# EAGLE design EC (EAGLE 6.2)
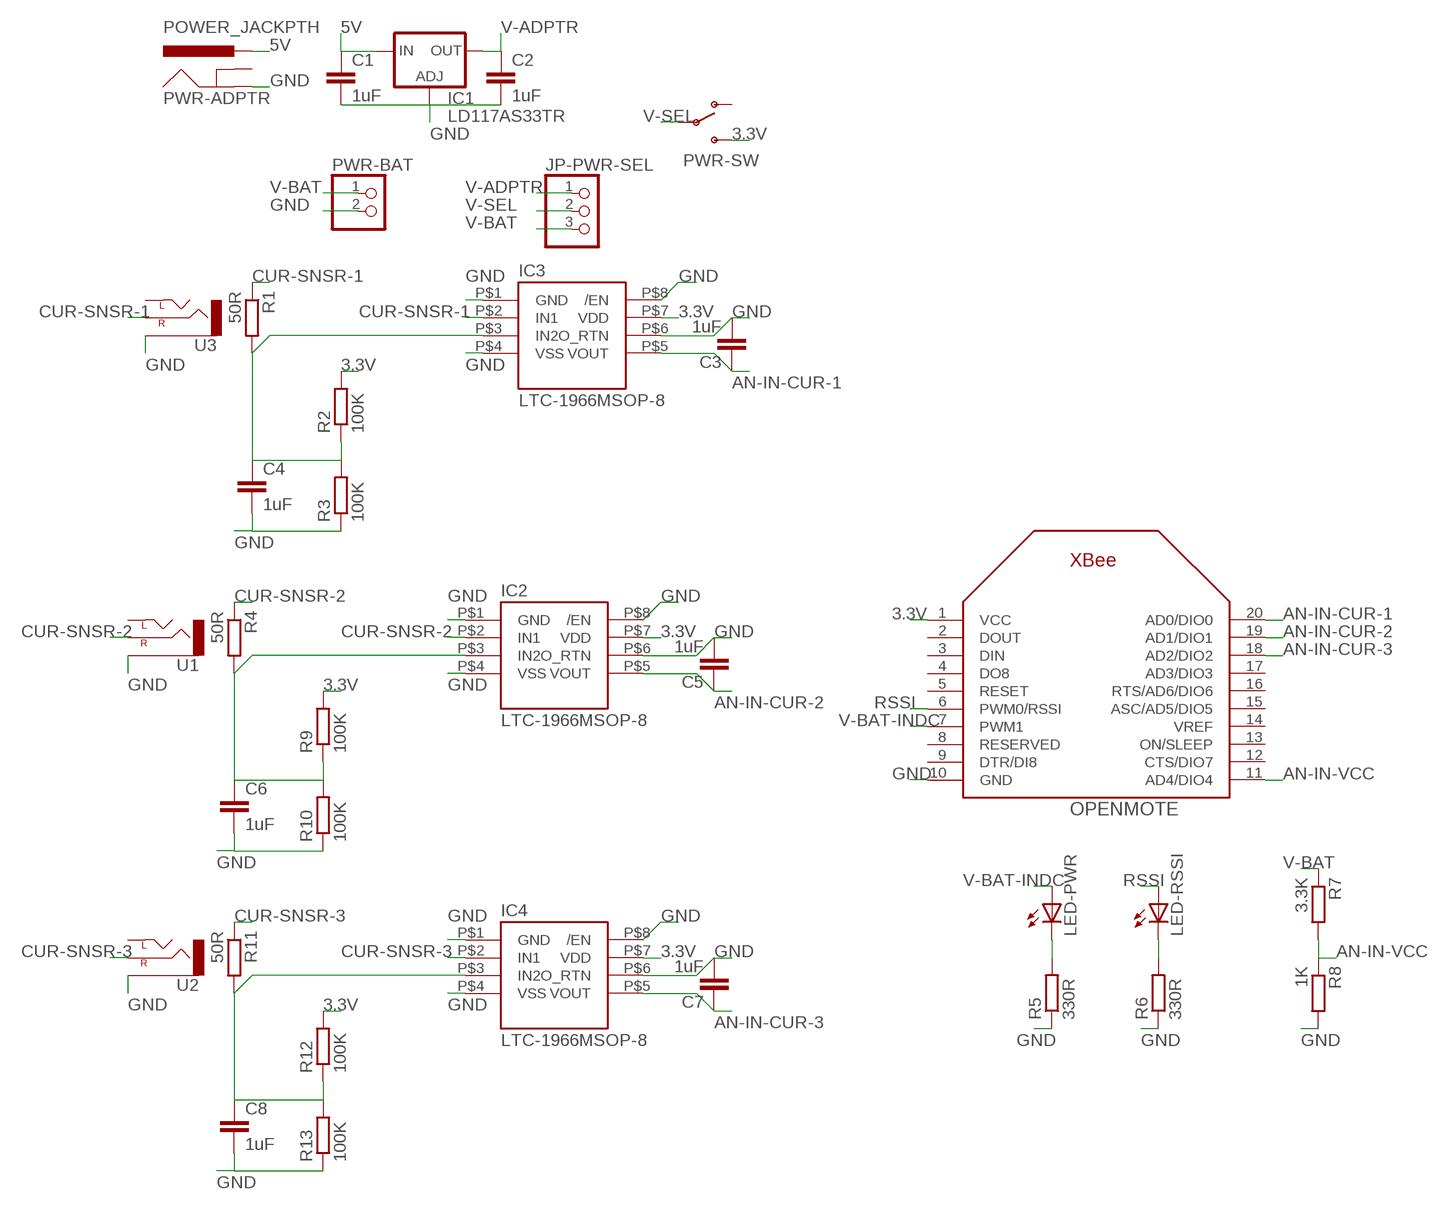
[diagram p0: schematic, sheet 1]

## Parts
C1  1uF  C-EUC0805  [C0805]
C2  1uF  C-EUC0805  [C0805]
C3  1uF  C-EUC0805  [C0805]
C4  1uF  C-EUC0805  [C0805]
C5  1uF  C-EUC0805  [C0805]
C6  1uF  C-EUC0805  [C0805]
C7  1uF  C-EUC0805  [C0805]
C8  1uF  C-EUC0805  [C0805]
IC1  LD117AS33TR  [SOT223]
IC2  LTC-1966MSOP-8  [MSOP-8]
IC3  LTC-1966MSOP-8  [MSOP-8]
IC4  LTC-1966MSOP-8  [MSOP-8]
JP-PWR-SEL  PINHD-1X3  [1X03]
LED-PWR  LED0603  [LED-0603]
LED-RSSI  LED0603  [LED-0603]
OPENMOTE  XBEE  [XBEE]
PWR-ADPTR  POWER_JACKPTH  [POWER_JACK_PTH]
PWR-BAT  PINHD-1X2  [1X02]
PWR-SW  SWITCH-SPDTSMD2  [SWITCH-SPDT-SMD]
R1  50R  R-EU_R0603  [R0603]
R2  100K  R-EU_R0603  [R0603]
R3  100K  R-EU_R0603  [R0603]
R4  50R  R-EU_R0603  [R0603]
R5  330R  R-EU_R0603  [R0603]
R6  330R  R-EU_R0603  [R0603]
R7  3.3K  R-EU_R0603  [R0603]
R8  1K  R-EU_R0603  [R0603]
R9  100K  R-EU_R0603  [R0603]
R10  100K  R-EU_R0603  [R0603]
R11  50R  R-EU_R0603  [R0603]
R12  100K  R-EU_R0603  [R0603]
R13  100K  R-EU_R0603  [R0603]
U1  AUDIO-JACKSMD2  [AUDIO-JACK-3.5MM-SMD]
U2  AUDIO-JACKSMD2  [AUDIO-JACK-3.5MM-SMD]
U3  AUDIO-JACKSMD2  [AUDIO-JACK-3.5MM-SMD]

## Nets
3.3V: IC2.P$7(VDD) IC3.P$7(VDD) IC4.P$7(VDD) OPENMOTE.1(VCC) PWR-SW.3(S) R2.2 R9.2 R12.2
5V: C1.1 IC1.3(IN) PWR-ADPTR.PWR
AN-IN-CUR-1: C3.1 IC3.P$5(VOUT) OPENMOTE.20(AD0/DIO0)
AN-IN-CUR-2: C5.1 IC2.P$5(VOUT) OPENMOTE.19(AD1/DIO1)
AN-IN-CUR-3: C7.1 IC4.P$5(VOUT) OPENMOTE.18(AD2/DIO2)
AN-IN-VCC: OPENMOTE.11(AD4/DIO4) R7.2 R8.1
CUR-SNSR-1: IC3.P$2(IN1) R1.1 U3.RING(RIGHT)
CUR-SNSR-2: IC2.P$2(IN1) R4.1 U1.RING(RIGHT)
CUR-SNSR-3: IC4.P$2(IN1) R11.1 U2.RING(RIGHT)
GND: C1.2 C2.2 C3.2 C4.2 C5.2 C6.2 C7.2 C8.2 IC1.1(ADJ) IC2.P$1(GND) IC2.P$4(VSS) IC2.P$6(O_RTN) IC2.P$8(/EN) IC3.P$1(GND) IC3.P$4(VSS) IC3.P$6(O_RTN) IC3.P$8(/EN) IC4.P$1(GND) IC4.P$4(VSS) IC4.P$6(O_RTN) IC4.P$8(/EN) OPENMOTE.10(GND) PWR-ADPTR.GND PWR-BAT.2 R3.1 R5.1 R6.1 R8.2 R10.1 R13.1 U1.SLEEVE U2.SLEEVE U3.SLEEVE
N$1: LED-PWR.C R5.2
N$2: LED-RSSI.C R6.2
N$3: C4.1 IC3.P$3(IN2) R1.2 R2.1 R3.2
N$4: C6.1 IC2.P$3(IN2) R4.2 R9.1 R10.2
N$5: C8.1 IC4.P$3(IN2) R11.2 R12.1 R13.2
RSSI: LED-RSSI.A OPENMOTE.6(PWM0/RSSI)
V-ADPTR: C2.1 IC1.4(OUT) JP-PWR-SEL.1
V-BAT: JP-PWR-SEL.3 PWR-BAT.1 R7.1
V-BAT-INDC: LED-PWR.A OPENMOTE.7(PWM1)
V-SEL: JP-PWR-SEL.2 PWR-SW.2(P)
Unconnected: OPENMOTE.2(DOUT) OPENMOTE.3(DIN) OPENMOTE.4(DO8) OPENMOTE.5(RESET) OPENMOTE.8(RESERVED) OPENMOTE.9(DTR/DI8) OPENMOTE.12(CTS/DIO7) OPENMOTE.13(ON/SLEEP) OPENMOTE.14(VREF) OPENMOTE.15(ASC/AD5/DIO5) OPENMOTE.16(RTS/AD6/DIO6) OPENMOTE.17(AD3/DIO3) PWR-ADPTR.GNDBREAK PWR-SW.1(O) U1.TIP(LEFT) U2.TIP(LEFT) U3.TIP(LEFT)

## Library data of the parts
C1-C8 = resistor:C-EU: CAPACITOR, European symbol
IC1 = v-reg:LD117A?*: Low drop fixed and adjustable positive voltage regulators 1 A Source: http://www.st.com/stonline/products/literature/ds/7194/ld1117axx.pdf
IC2-IC4 = custom-tigor:LTC-1966
JP-PWR-SEL = pinhead:PINHD-1X3: PIN HEADER
LED-PWR LED-RSSI = SparkFun-LED:LED: LEDs Standard schematic elements and footprints for 5mm, 3mm, 1206, and 0603 sized LEDs. 5mm - Spark Fun Electronics SKU : COM-00529 (and others)
OPENMOTE = adafruit:XBEE
PWR-ADPTR = SparkFun-Connectors:POWER_JACK: Power Jack This is the standard 5.5mm barrel jack for power. The PTH is the most common, proven, reliable, footprint. The Slot footprint only works if the mill layer is transmitted to the PCB fab house so be warned. Spark Fun Electronics SKU : PRT-00119 SMT: CONN-08106 Mating wall wart : TOL-00298 (and others)
PWR-BAT = pinhead:PINHD-1X2: PIN HEADER
PWR-SW = SparkFun-Electromechanical:SWITCH-SPDT: SPDT Switch Simple slide switch, Spark Fun Electronics SKU : COM-00102 DPDT SMT slide switch, AYZ0202, SWCH-08179
R1-R13 = resistor:R-EU_: RESISTOR, European symbol
U1-U3 = SparkFun-Connectors:AUDIO-JACK: 3.5mm Audio Jack Simple 3.5mm common PCB mount audio jack. SKU: PRT-08032

## Board
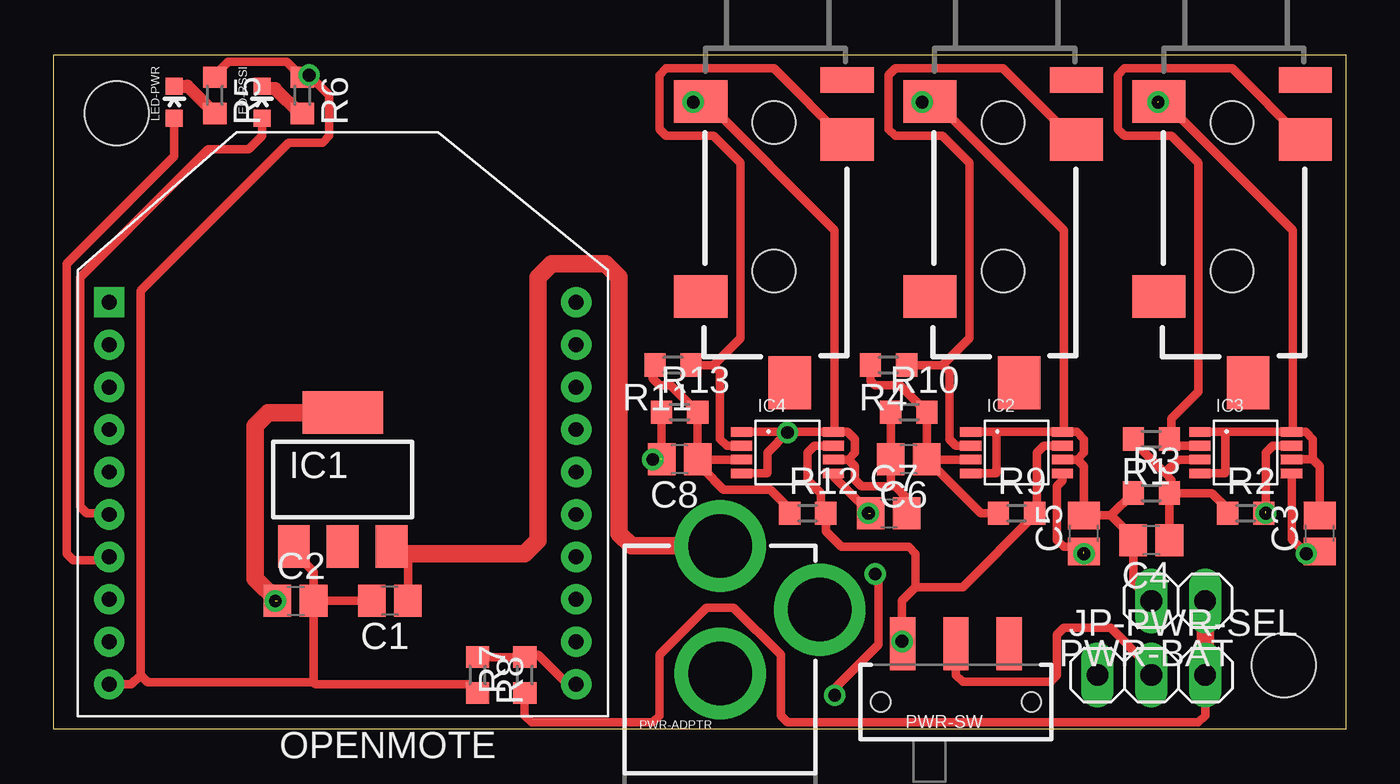
[diagram p1: board, top side]
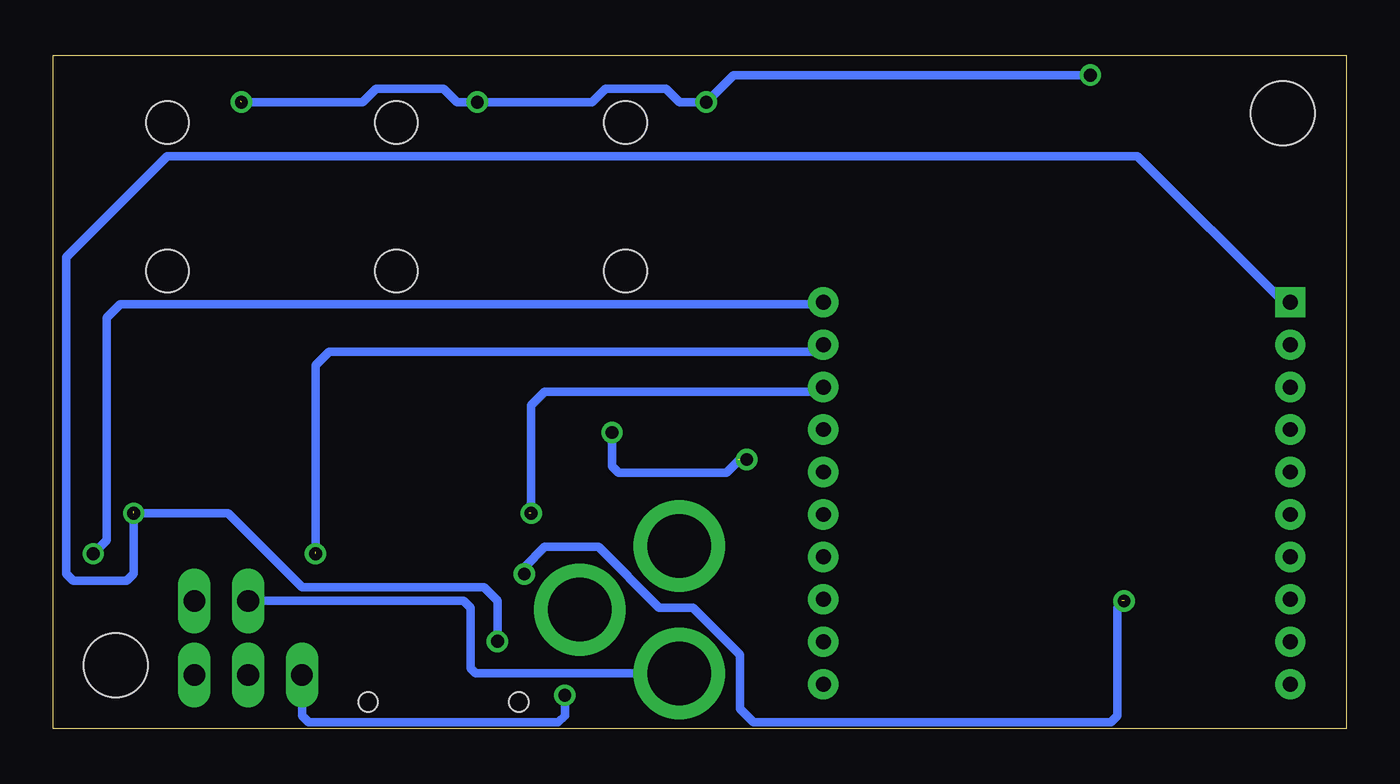
[diagram p2: board, bottom side, seen from below]

Size 60.95 x 31.74 mm. Coordinates in mm from the lower left corner, seen from the top.
Outline: 0,0 60.95,0 60.95,31.74 0,31.74 0,0
Copper layers (1*16): Top 0.035mm / dielectric 1.5mm / Bottom 0.035mm
Design rules: minimum track width 10mil, minimum drill 24mil, track to track 8mil, track to pad 8mil, pad to pad 8mil, via to via 8mil, smd to smd 8mil, copper to edge 40mil, drill to drill 8mil, minimum pad ring 10mil, minimum via ring 8mil, stop-mask expansion 4mil, vias tented up to drill 0mil, thermal gap 10mil
Holes 3 mm at 3,29 58,3

### Footprints (pad centres in the part's own frame; a part is rotated, then mirrored left to right if it is on the bottom)
C0805 = smd 1.3 x 1.5: 1 -0.85,0; 2 0.85,0
SOT223 = smd 1.5 x 2: 1 -2.3,-3.15; 2 0,-3.15; 3 2.3,-3.15 | smd 3.8 x 2: 4 0,3.15
MSOP-8 = smd 0.45 x 1: P$1 -0.975,-2.165; P$2 -0.325,-2.165; P$3 0.325,-2.165; P$4 0.975,-2.165; P$5 0.975,2.165; P$6 0.325,2.165; P$7 -0.325,2.165; P$8 -0.975,2.165
1X03 = drill 1.016 long: 1 -2.54,0; 2 0,0; 3 2.54,0
LED-0603 = smd 0.8 x 0.8: A 0,-0.75; C 0,0.75
XBEE = drill 0.7 pad 1.422 square: 1 -11,5.5 | drill 0.7 pad 1.422: 2 -11,3.5; 3 -11,1.5; 4 -11,-0.5; 5 -11,-2.5; 6 -11,-4.5; 7 -11,-6.5; 8 -11,-8.5; 9 -11,-10.5; 10 -11,-12.5; 11 11,-12.5; 12 11,-10.5; 13 11,-8.5; 14 11,-6.5; 15 11,-4.5; 16 11,-2.5; 17 11,-0.5; 18 11,1.5; 19 11,3.5; 20 11,5.5
POWER_JACK_PTH = drill 2.997 pad 4.318: GND 0,7.7; GNDBREAK 4.7,10.7; PWR 0,13.7
1X02 = drill 1.016 long: 1 -1.27,0; 2 1.27,0
SWITCH-SPDT-SMD = smd 1.2 x 2.5: 1 -2.5,-2.75; 2 0,-2.75; 3 2.5,-2.75 | hole 0.9: -3.55,0; 3.55,0
R0603 = smd 1 x 1.1: 1 -0.85,0; 2 0.85,0
AUDIO-JACK-3.5MM-SMD = smd 2 x 2.5: RING 4.3,3.45; SLEEVE 2.5,-3.45; TIP 11.7,-3.45 | smd 1.2 x 2.5: RSH 1.5,3.45 | smd 2.5 x 2: TSH 15.75,0.75 | hole 2: 3.5,0; 10.5,0

### Placement (x,y rotation side)
C1  15.88,6.03 180 top
C2  11.43,6.03 0 top
C3  59.69,9.21 90 top
C4  51.75,8.89 180 top
C5  48.58,9.21 90 top
C6  40.32,12.7 180 top
C7  39.37,10.16 0 top
C8  29.53,12.7 180 top
IC1  13.65,11.75 0 top
IC2  45.4,13.02 270 top
IC3  56.2,13.02 270 top
IC4  34.61,13.02 270 top
JP-PWR-SEL  51.75,2.54 0 top
LED-PWR  5.71,29.53 0 top
LED-RSSI  9.84,29.53 0 top
OPENMOTE  13.65,14.61 0 top
PWR-ADPTR  31.43,-5.08 0 top
PWR-BAT  53.02,6.03 180 top
PWR-SW  42.55,1.27 180 top
R1  51.75,13.65 180 top
R2  56.2,10.16 0 top
R3  51.75,11.11 0 top
R4  39.37,17.14 180 top
R5  7.62,29.84 270 top
R6  11.75,29.84 270 top
R7  22.23,2.54 90 top
R8  20,2.54 270 top
R9  45.4,10.16 0 top
R10  40.32,14.92 0 top
R11  29.21,17.14 180 top
R12  35.56,10.16 0 top
R13  29.53,14.92 0 top
U1  44.77,32.07 270 top
U2  33.97,32.07 270 top
U3  55.56,32.07 270 top

### Tracks (layer width: path | path; a pad name or v marks a point on that pad's centre or on a via)
3.3V  (via drill 0.6)  (1 unrouted)
  Top 0.406: IC3.P$7 57.48,13.34 57.15,13.02 57.15,10.26 R2.2 | IC2.P$7 46.68,13.34 46.35,13.02 46.35,10.26 R9.2 46.25,10.06 42.86,6.67 40.64,6.67 | PWR-SW.3 40.01,4.06 v40.01,4.13 40.01,6.03 40.64,6.67 | IC4.P$7 35.88,13.34 35.56,13.02 35.56,11.75 36.2,11.11 36.2,10.38 R12.2 36.41,9.31 37.15,8.57 40.32,8.57 40.64,8.26 40.64,6.67
  Bottom 0.406: v40.01,4.13 40.01,6.03 40.64,6.67 49.21,6.67 52.7,10.16 v57.15,10.16 57.15,7.3 57.47,6.99 60.01,6.99 60.33,7.3 60.33,22.23 55.56,26.99 9.84,26.99 2.96,20.11 OPENMOTE.1
5V
  Top 0.406: C1.1 16.73,7.83 IC1.3
  Top 0.813: PWR-ADPTR.PWR 27.26,8.62 26.67,9.21 26.67,21.27 26.04,21.91 23.5,21.91 22.86,21.27 22.86,8.89 22.23,8.26 16.3,8.26 IC1.3
AN-IN-CUR-1  (via drill 0.6)
  Top 0.406: C3.1 59.59,8.26 v59.05,8.26 58.36,8.95 IC3.P$5
  Bottom 0.406: v59.05,8.26 58.42,8.89 58.42,19.37 57.78,20 24.75,20 OPENMOTE.20
AN-IN-CUR-2  (via drill 0.6)  (1 unrouted)
  Top 0.406: IC2.P$5 47.57,11.69 47.31,11.43 47.31,8.89 47.62,8.57 48.36,8.57 C5.1
  Bottom 0.406: v48.58,8.26 48.58,17.14 47.94,17.78 24.98,17.78 OPENMOTE.19
AN-IN-CUR-3  (via drill 0.6)  (1 unrouted)
  Top 0.406: IC4.P$5 36.77,11.91 C7.1
  Bottom 0.406: v38.42,10.16 38.42,15.24 37.78,15.88 24.88,15.88 OPENMOTE.18
AN-IN-VCC
  Top 0.406: OPENMOTE.11 24.25,2.1 22.86,3.49 22.33,3.49 R7.2 R8.1
CUR-SNSR-1
  Top 0.406: U3.RING 58.91,27.77 55.56,31.11 50.48,31.11 50.16,30.8 50.16,28.26 50.48,27.94 52.7,27.94 53.98,26.67 53.98,15.88 52.7,14.61 52.7,13.76 R1.1 52.91,13.34 IC3.P$2
CUR-SNSR-2
  Top 0.406: IC2.P$2 42.54,13.34 42.23,13.65 42.23,16.83 41.91,17.14 | R4.1 41.91,17.14 | U1.RING 48.12,27.77 44.77,31.11 39.69,31.11 39.37,30.8 39.37,28.26 39.69,27.94 41.91,27.94 43.18,26.67 43.18,18.41 41.91,17.14
CUR-SNSR-3
  Top 0.406: 31.11,17.14 31.43,16.83 31.43,13.65 31.75,13.34 IC4.P$2 | U2.RING 37.32,27.77 33.97,31.11 28.89,31.11 28.57,30.8 28.57,28.26 28.89,27.94 31.11,27.94 32.38,26.67 32.38,18.41 31.11,17.14 | 31.11,17.14 R11.1
GND  (via drill 0.6)  (2 unrouted)
  Top 0.406: U3.SLEEVE 52.35,29.57 58.42,23.5 58.42,14.05 IC3.P$8 | R5.1 7.62,30.8 8.26,31.43 11.01,31.43 R6.1 11.85,30.8 v12.06,30.8 13.02,29.84 13.02,27.94 12.7,27.62 11.11,27.62 4.13,20.64 4.13,2.54 | C3.2 59.69,12.38 59.37,12.7 | 59.37,12.7 IC3.P$6 | IC3.P$8 59.03,13.99 59.37,13.65 59.37,12.7 | IC3.P$1 55.24,13.99 | 55.24,13.99 IC3.P$8 | IC3.P$4 55.22,12.04 55.24,12.06 55.24,13.99 | IC2.P$6 48.27,12.69 | 48.27,12.69 48.58,12.38 C5.2 49.85,10.06 | IC2.P$8 48.24,13.99 48.58,13.65 48.58,13 48.27,12.69 | IC2.P$8 44.45,13.99 | 44.45,13.99 IC2.P$1 | IC2.P$4 44.43,12.04 44.45,12.06 44.45,13.99 | R10.1 C6.2 39.47,11.53 39.37,11.43 | IC2.P$8 47.62,14.05 47.62,23.5 41.55,29.57 U1.SLEEVE 41.28,29.53 v40.96,29.53 | IC4.P$6 37.47,12.69 | IC4.P$1 34.59,13.99 v34.61,13.97 | IC4.P$8 37.44,13.99 37.78,13.65 37.78,13 37.47,12.69 | IC4.P$4 33.63,12.04 33.66,12.06 33.66,13.02 v34.61,13.97 | R13.1 C8.2 | IC4.P$8 36.83,14.05 36.83,23.5 30.76,29.57 U2.SLEEVE 30.48,29.53 v30.16,29.53 | R8.2 19.59,2.1 12.38,2.1 12.28,2.21 | C2.2 12.28,2.21 | C1.2 C2.2 | C2.2 12.28,7.41 11.75,7.94 11.75,8.2 IC1.1 | C7.2 40.22,10.9 39.69,11.43 39.37,11.43 | 39.37,11.43 38.1,11.43 37.78,11.75 37.78,12.38 37.47,12.69 | 49.85,10.06 R3.1 | 49.85,10.06 50.9,9 C4.2 50.9,6.88 PWR-BAT.2 | OPENMOTE.10 3.69,2.1 4.13,2.54 | 12.28,2.21 4.46,2.21 4.13,2.54 | IC4.P$8 34.63,13.99 v34.61,13.97
  Bottom 0.406: v12.06,30.8 28.89,30.8 v30.16,29.53 31.43,29.53 32.07,30.16 34.92,30.16 35.56,29.53 v40.96,29.53 41.91,29.53 42.55,30.16 45.72,30.16 46.35,29.53 v52.07,29.53 52.39,29.53 | PWR-ADPTR.GND 41.04,2.62 41.27,2.86 41.27,5.71 41.59,6.03 PWR-BAT.2 | v28.26,12.7 28.57,12.7 29.21,12.06 34.29,12.06 34.61,12.38 v34.61,13.97
N$1
  Top 0.61: LED-PWR.C 6.34,30.28 R5.2
N$2
  Top 0.61: R6.2 11.64,29 10.48,30.16 9.96,30.16 LED-RSSI.C
N$3
  Top 0.406: R2.1 55.35,10.38 54.61,11.11 R3.2 | R3.2 C4.1 | R1.2 50.9,13.55 52.39,12.06 | 52.39,12.06 52.7,11.75 52.7,11.21 R3.2 | IC3.P$3 53.02,12.69 52.39,12.06
N$4
  Top 0.406: R9.1 43.71,10.16 C6.1 | IC2.P$3 C6.1 | C6.1 R10.2 39.9,16.19 38.73,16.19 38.52,16.41 R4.2
N$5
  Top 0.406: IC4.P$3 C8.1 | C8.1 R13.2 29.11,16.19 28.57,16.19 28.26,16.51 28.26,17.04 R11.2 | R12.1 34.71,10.38 33.81,11.27 31.59,11.27 30.64,12.22 30.64,12.44 C8.1
RSSI
  Top 0.406: LED-RSSI.A 9.84,27.94 9.21,27.3 7.3,27.3 1.27,21.27 1.27,10.48 1.59,10.16 2.6,10.16 OPENMOTE.6
V-ADPTR  (via drill 0.6)  (1 unrouted)
  Top 0.406: v36.83,1.59 36.83,1.91 38.89,3.97 38.89,7.14 v38.73,7.3
  Top 0.813: IC1.4 10.13,14.9 9.53,14.29 9.53,7.09 C2.1
  Bottom 0.406: JP-PWR-SEL.1 49.21,0.64 48.9,0.32 37.15,0.32 36.83,0.64 v36.83,1.59 | v38.73,7.3 38.73,7.62 37.78,8.57 35.24,8.57 32.38,5.71 30.8,5.71 28.57,3.49 28.57,0.95 27.94,0.32 11.11,0.32 10.79,0.64 10.79,5.71 v10.48,6.03
V-BAT
  Top 0.406: JP-PWR-SEL.3 54.29,0.64 53.98,0.32 34.61,0.32 34.29,0.64 34.29,3.49 32.07,5.71 30.8,5.71 28.57,3.49 28.57,0.64 28.26,0.32 22.54,0.32 22.23,0.64 R7.1
  Top 0.813: PWR-BAT.1 JP-PWR-SEL.3
V-BAT-INDC
  Top 0.406: LED-PWR.A 5.71,26.99 0.64,21.91 0.64,8.26 0.95,7.94 2.48,7.94 OPENMOTE.7
V-SEL
  Top 0.406: PWR-SW.2 42.55,2.54 42.86,2.22 46.99,2.22 47.31,2.54 47.31,4.45 47.62,4.76 49.85,4.76 51.44,3.17 51.44,2.86 JP-PWR-SEL.2